# EAGLE design STM32F103C8T6 (EAGLE 9.6.2)
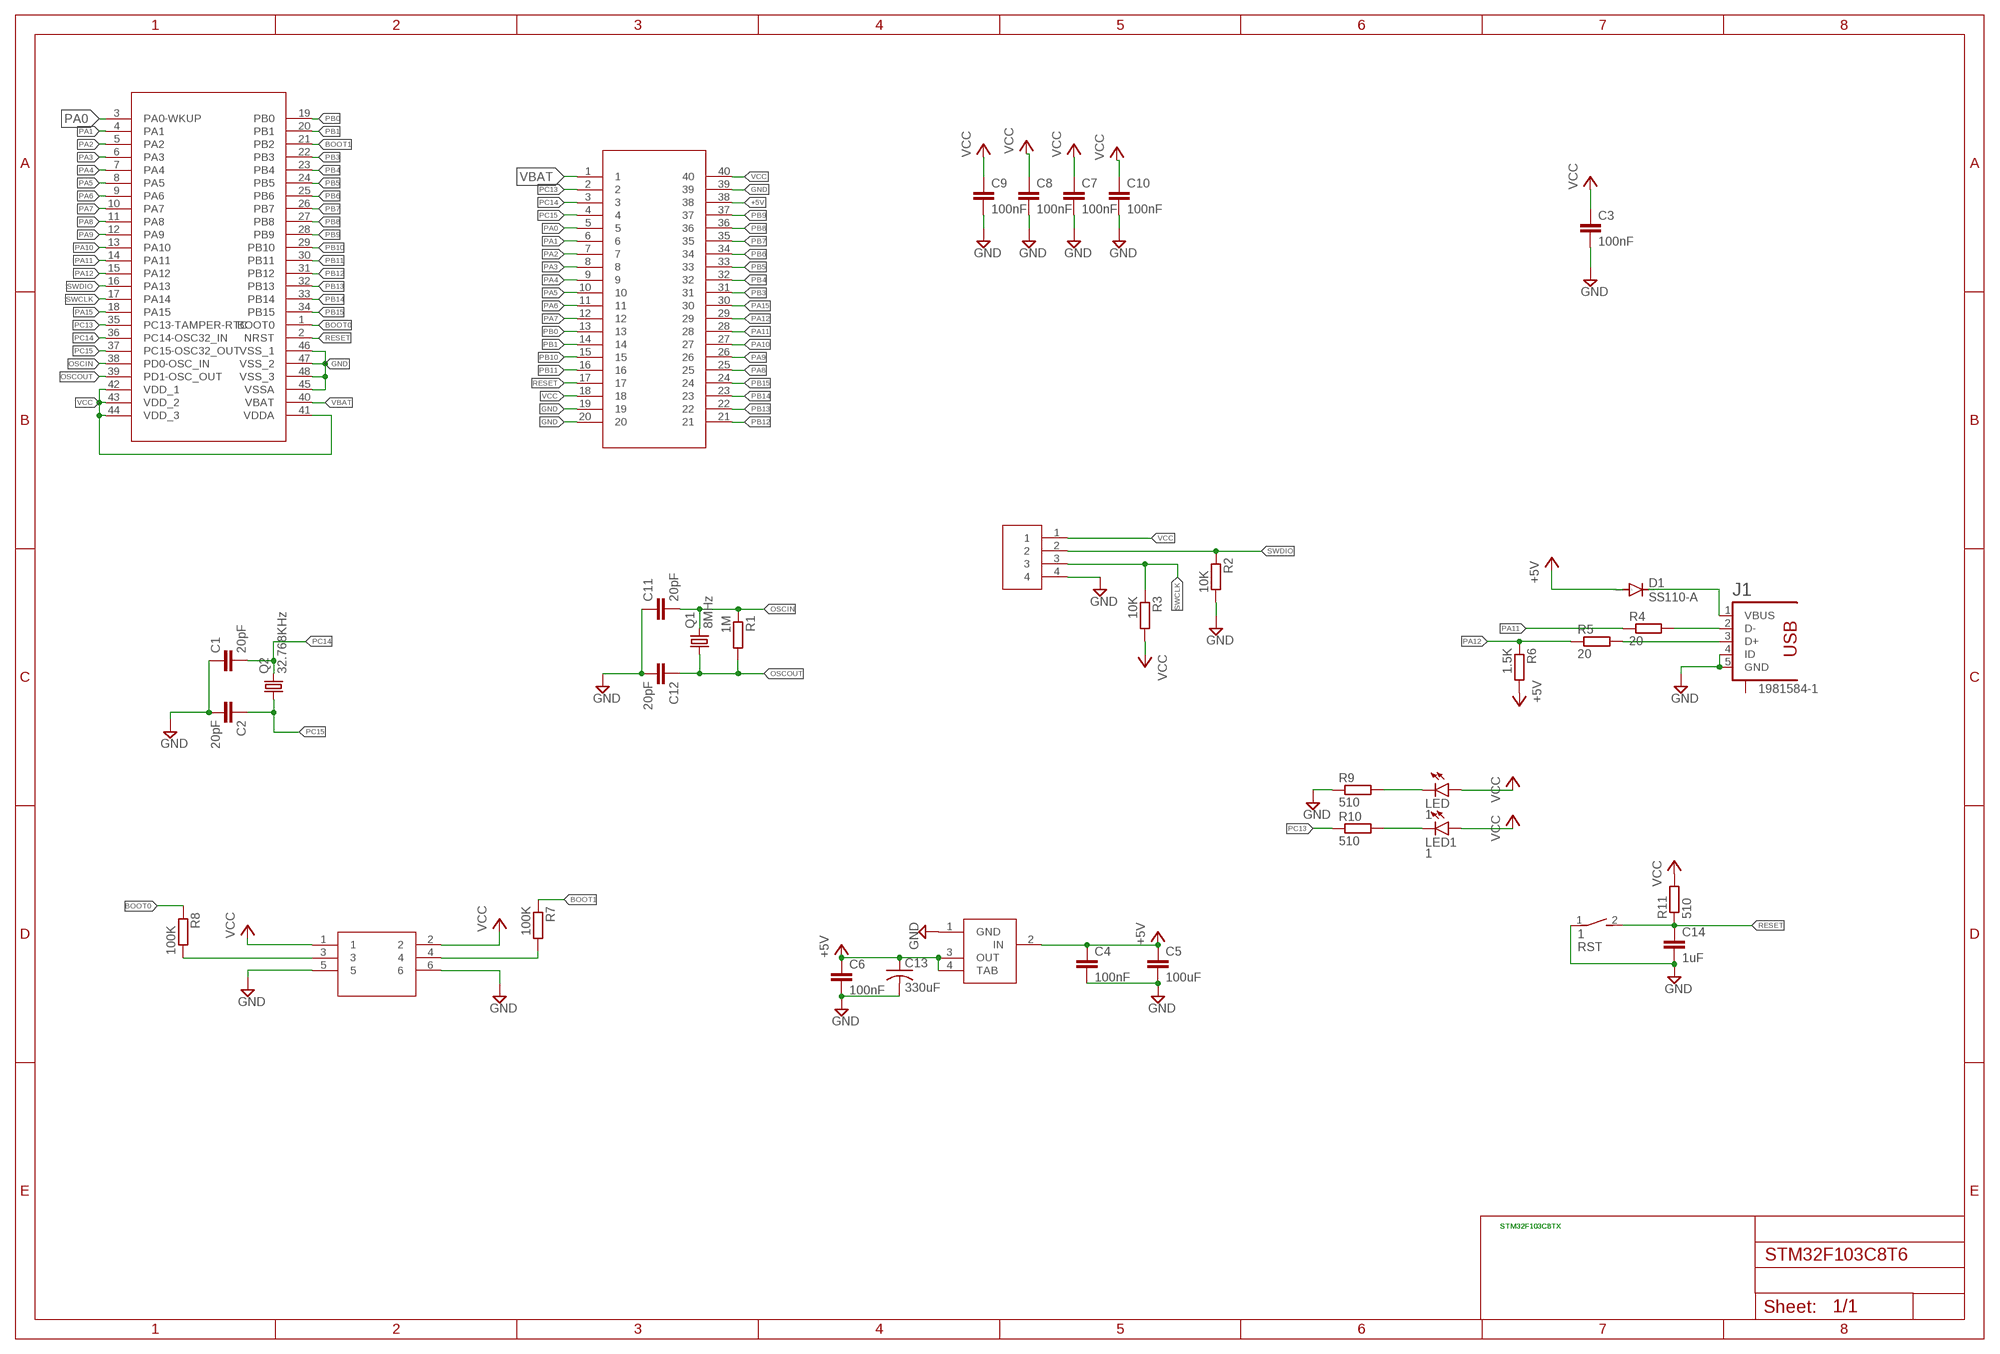
[diagram p0: schematic, sheet 1]

## Parts
1  RST  DS01E  [DS-01]
C1  20pF  C-EU025-024X044  [C025-024X044]
C2  20pF  C-EU025-024X044  [C025-024X044]
C3  100nF  C-EU025-024X044  [C025-024X044]
C4  100nF  C-EU025-024X044  [C025-024X044]
C5  100uF  C-EU025-024X044  [C025-024X044]
C6  100nF  C-EU025-024X044  [C025-024X044]
C7  100nF  C-EU025-024X044  [C025-024X044]
C8  100nF  C-EU025-024X044  [C025-024X044]
C9  100nF  C-EU025-024X044  [C025-024X044]
C10  100nF  C-EU025-024X044  [C025-024X044]
C11  20pF  C-EU025-024X044  [C025-024X044]
C12  20pF  C-EU025-024X044  [C025-024X044]
C13  330uF  C-US050-024X044  [C050-024X044]
C14  1uF  C-EU025-024X044  [C025-024X044]
D1  SS110-A  DIODE-D-2.5  [D-2.5]
J1  1981584-1  [1981584-1]
LED  1  LED3MM  [LED3MM]
LED1  1  LED3MM  [LED3MM]
Q1  8MHz  CRYSTALSM49  [SM49]
Q2  32.768KHz  CRYSTALSM49  [SM49]
R1  1M  R-EU_0204/2V  [0204V]
R2  10K  R-EU_0204/2V  [0204V]
R3  10K  R-EU_0204/2V  [0204V]
R4  20  R-EU_0204/2V  [0204V]
R5  20  R-EU_0204/2V  [0204V]
R6  1.5K  R-EU_0204/2V  [0204V]
R7  100K  R-EU_0204/2V  [0204V]
R8  100K  R-EU_0204/2V  [0204V]
R9  510  R-EU_0204/2V  [0204V]
R10  510  R-EU_0204/2V  [0204V]
R11  510  R-EU_0204/2V  [0204V]
U$1  STM32F103C8T6  [QFP50P1290X1290X120-48N]
U$2  GPINS  [HDRV40W64P254_20X2_1016X508X838B]
U$4  PLATE  [HDRV4W64P254_1X4_1016X508X838B]
U$5  IC  [DIP762W53P254L500H508Q6B]
U$6  SOT223  [SOT230P700X180-4N]

## Nets
+5V: D1.A LED1.A LED.A R6.2 R11.2 U$2.38 ; supply symbol labelled VCC
BOOT0: R8.1 U$1.1(BOOT0)
BOOT1: R7.1 U$1.21(PB2)
GND: 1.1 C1.1 C2.2 C3.2 C4.2 C5.2 C6.2 C7.2 C8.2 C9.2 C10.2 C11.1 C12.2 C13.2 C14.2 J1.4(ID) J1.5(GND) R2.2 R9.1 U$1.45(VSSA) U$1.46(VSS_1) U$1.47(VSS_2) U$1.48(VSS_3) U$2.19 U$2.20 U$2.39 U$4.4 U$5.5 U$5.6 U$6.1(GND)
N$1: D1.C J1.1(VBUS)
N$2: R8.2 U$5.3
N$3: J1.2(D-) R4.2
N$4: R7.2 U$5.4
N$5: J1.3(D+) R5.2
N$8: LED.K(C) R9.2
N$9: LED1.K(C) R10.2
OSCIN: C11.2 Q1.2 R1.1 U$1.38(PD0-OSC_IN)
OSCOUT: C12.1 Q1.1 R1.2 U$1.39(PD1-OSC_OUT)
PA0: U$1.3(PA0-WKUP) U$2.5
PA1: U$1.4(PA1) U$2.6
PA2: U$1.5(PA2) U$2.7
PA3: U$1.6(PA3) U$2.8
PA4: U$1.7(PA4) U$2.9
PA5: U$1.8(PA5) U$2.10
PA6: U$1.9(PA6) U$2.11
PA7: U$1.10(PA7) U$2.12
PA8: U$1.11(PA8) U$2.25
PA9: U$1.12(PA9) U$2.26
PA10: U$1.13(PA10) U$2.27
PA11: R4.1 U$1.14(PA11) U$2.28
PA12: R5.1 R6.1 U$1.15(PA12) U$2.29
PA15: U$1.18(PA15) U$2.30
PB0: U$1.19(PB0) U$2.13
PB1: U$1.20(PB1) U$2.14
PB3: U$1.22(PB3) U$2.31
PB4: U$1.23(PB4) U$2.32
PB5: U$1.24(PB5) U$2.33
PB6: U$1.25(PB6) U$2.34
PB7: U$1.26(PB7) U$2.35
PB8: U$1.27(PB8) U$2.36
PB9: U$1.28(PB9) U$2.37
PB10: U$1.29(PB10) U$2.15
PB11: U$1.30(PB11) U$2.16
PB12: U$1.31(PB12) U$2.21
PB13: U$1.32(PB13) U$2.22
PB14: U$1.33(PB14) U$2.23
PB15: U$1.34(PB15) U$2.24
PC13: R10.1 U$1.35(PC13-TAMPER-RTC) U$2.2
PC14: C1.2 Q2.2 U$1.36(PC14-OSC32_IN) U$2.3
PC15: C2.1 Q2.1 U$1.37(PC15-OSC32_OUT) U$2.4
RESET: 1.2 C14.1 R11.1 U$1.2(NRST) U$2.17
SWCLK: R3.1 U$1.17(PA14) U$4.3
SWDIO: R2.1 U$1.16(PA13) U$4.2
VBAT: U$1.40(VBAT) U$2.1
VCC: C3.1 C4.1 C5.1 C6.1 C7.1 C8.1 C9.1 C10.1 C13.1 R3.2 U$1.41(VDDA) U$1.42(VDD_1) U$1.43(VDD_2) U$1.44(VDD_3) U$2.18 U$2.40 U$4.1 U$5.1 U$5.2 U$6.2(IN) U$6.3(OUT) U$6.4(TAB) ; supply symbol labelled +5V
Unconnected: J1.S1

## Notes on the sheet
- STM32F103C8TX | STM32F103C8TX

## Library data of the parts
1 = switch-dil:DS01E: DIL/CODE SWITCH; OC_FARNELL: unknown; OC_NEWARK: unknown
C1-C12 C14 = rcl:C-EU: CAPACITOR, European symbol; SPICEPREFIX: C
C13 = rcl:C-US: CAPACITOR, American symbol; SPICEPREFIX: C
D1 = diode:DIODE-: DIODE
J1 = audio amplifier example:1981584-1: Receptacle, micro-USB, type A/B Tyco Electronics
LED LED1 = led:LED: LED OSRAM: - CHIPLED LG R971, LG N971, LY N971, LG Q971, LY Q971, LO R971, LY R971 LH N974, LH R974 LS Q976, LO Q976, LY Q976 LO Q996 - Hyper CHIPLED LW Q18S LB Q993, LB Q99A, LB R99A - SideLED LS A670, LO A670, LY A670, LG A670, LP A670 LB A673, LV A673, LT A673, LW A673 LH A674 LY A675 LS A676, LA A676, LO A676, LY A676, LW A676 LS A679, LY A679, LG A679 - Hyper Micro SIDELED® LS Y876, LA Y876, LO Y876, LY Y876 LT Y87S - SmartLED LW L88C, LW L88S LB L89C, LB L89S, LG L890 LS L89K, LO L89K, LY L89K LS L896, LA L896, LO L896, LY L896 - TOPLED LS T670, LO T670, LY T670, LG T670, LP T670 LSG T670, LSP T670, LSY T670, LOP T670, LYG T670 LG T671, LOG T671, LSG T671 LB T673, LV T673, LT T673, LW T673 LH T674 LS T676, LA T676, LO T676, LY T676, LB T676, LH T676, LSB T676, LW T676 LB T67C, LV T67C, LT T67C, LS T67K, LO T67K, LY T67K, LW E67C LS E67B, LA E67B, LO E67B, LY E67B, LB E67C, LV E67C, LT E67C LW T67C LS T679, LY T679, LG T679 LS T770, LO T770, LY T770, LG T770, LP T770 LB T773, LV T773, LT T773, LW T773 LH T774 LS E675, LA E675, LY E675, LS T675 LS T776, LA T776, LO T776, LY T776, LB T776 LHGB T686 LT T68C, LB T68C - Hyper Mini TOPLED® LB M676 - Mini TOPLED Santana® LG M470 LS M47K, LO M47K, LY M47K Source: http://www.osram.convergy.de LUXEON: - LUMILED® LXK2-PW12-R00, LXK2-PW12-S00, LXK2-PW14-U00, LXK2-PW14-V00 LXK2-PM12-R00, LXK2-PM12-S00, LXK2-PM14-U00 LXK2-PE12-Q00, LXK2-PE12-R00, LXK2-PE12-S00, LXK2-PE14-T00, LXK2-PE14-U00 LXK2-PB12-K00, LXK2-PB12-L00, LXK2-PB12-M00, LXK2-PB14-N00, LXK2-PB14-P00, LXK2-PB14-Q00 LXK2-PR12-L00, LXK2-PR12-M00, LXK2-PR14-Q00, LXK2-PR14-R00 LXK2-PD12-Q00, LXK2-PD12-R00, LXK2-PD12-S00 LXK2-PH12-R00, LXK2-PH12-S00 LXK2-PL12-P00, LXK2-PL12-Q00, LXK2-PL12-R00 Source: www.luxeon.com KINGBRIGHT: KA-3528ASYC Source: www.kingbright.com
Q1 Q2 = crystal:CRYSTAL: CRYSTAL; OC_FARNELL: unknown; OC_NEWARK: unknown
R1-R11 = rcl:R-EU_: RESISTOR, European symbol; SPICEPREFIX: R
U$1 = STM32F103C8T6:STM32F103C8T6
U$2 = PLATES:GPINS
U$4 = PLATE:PLATE
U$5 = BOX:IC
U$6 = SOT:SOT223

## Board
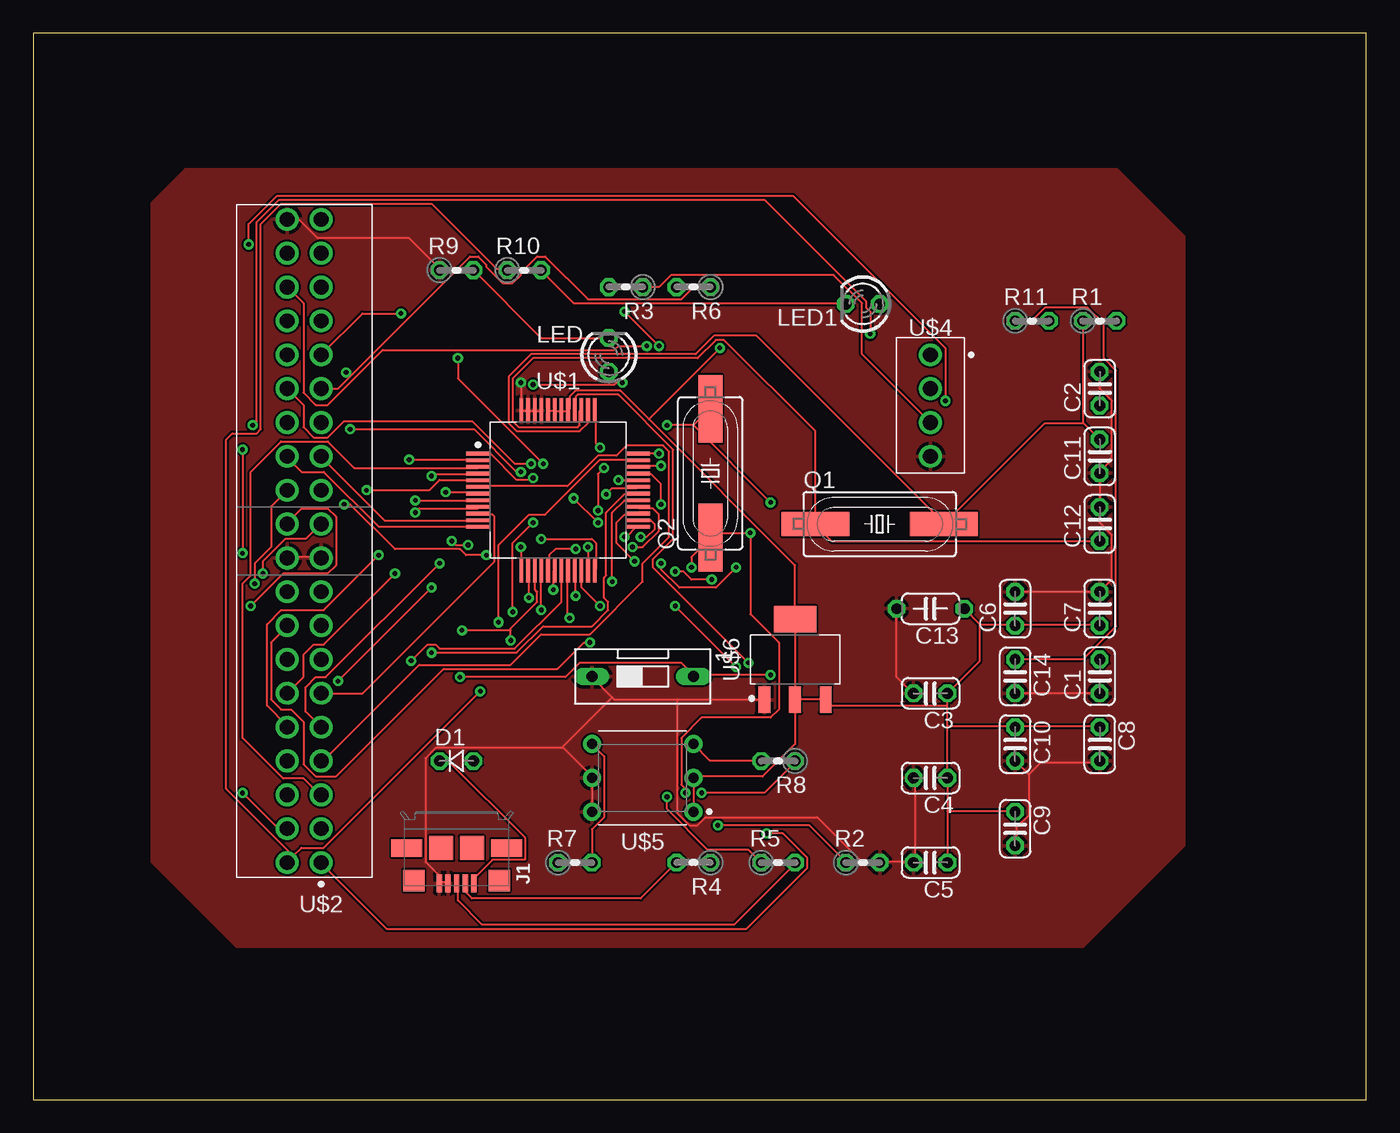
[diagram p1: board, top side]
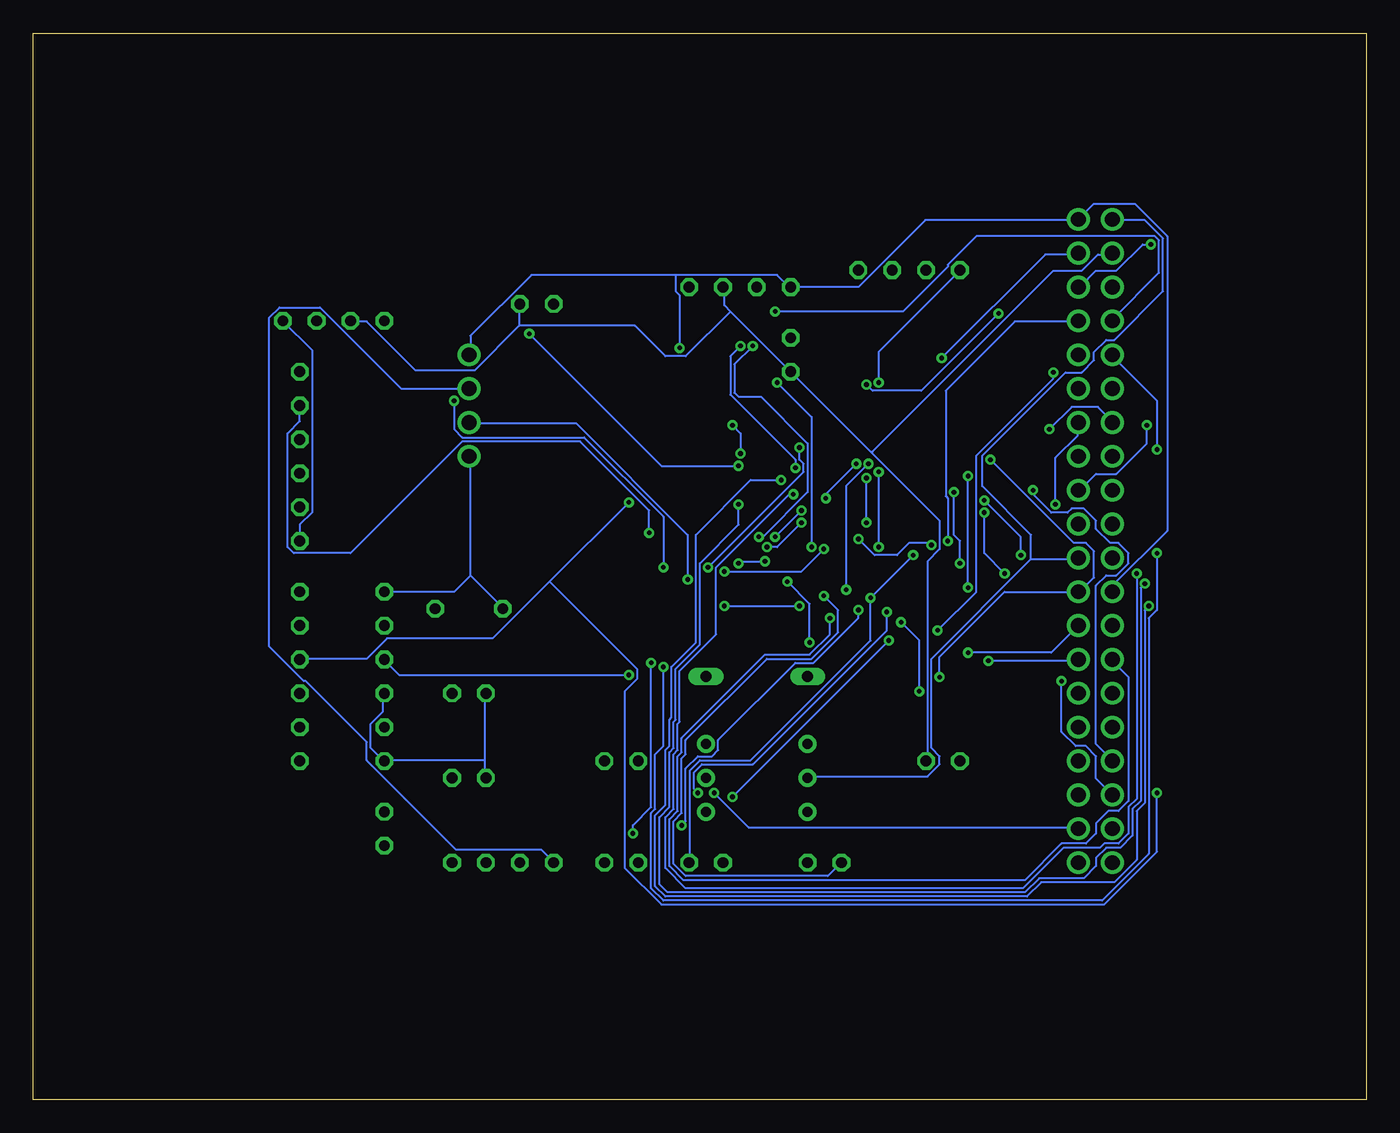
[diagram p2: board, bottom side, seen from below]

Size 100 x 80 mm. Coordinates in mm from the lower left corner, seen from the top.
Outline: 0,0 100,0 100,80 0,80 0,0
Copper layers (1*16): Top 0.035mm / dielectric 1.5mm / Bottom 0.035mm
Design rules "default": minimum track width 6mil, minimum drill 0.35mm, track to track 6mil, track to pad 6mil, pad to pad 6mil, via to via 6mil, smd to smd 6mil, copper to edge 40mil, drill to drill 6mil, minimum pad ring 10mil, minimum via ring 8mil, stop-mask expansion 4mil, vias tented up to drill 0mil, thermal gap 10mil

### Footprints (pad centres in the part's own frame; a part is rotated, then mirrored left to right if it is on the bottom)
DS-01 = drill 0.813 long: 1 0,-3.81; 2 0,3.81
C025-024X044 = drill 0.813 octagon: 1 -1.27,0; 2 1.27,0
C050-024X044 = drill 0.813 octagon: 1 -2.54,0; 2 2.54,0
D-2.5 = drill 0.813 octagon: A 1.27,0; C -1.27,0
1981584-1 = smd 0.4 x 1.35: 1 -1.3,4.1; 2 -0.65,4.1; 3 0,4.1; 4 0.65,4.1; 5 1.3,4.1 | smd 1.8 x 1.8: M1 -1.15,1.45; M2 1.15,1.45 | smd 2.3 x 1.3: S1 -3.75,1.45; S2 3.75,1.45 | smd 1.6 x 1.6: S3 -3.2,3.885; S4 3.2,3.885
LED3MM = drill 0.813 octagon: A -1.27,0; K 1.27,0
SM49 = smd 5.08 x 1.778: 1 -4.826,0; 2 4.826,0
0204V = drill 0.813 octagon: 1 -1.27,0; 2 1.27,0
QFP50P1290X1290X120-48N = smd 1.852 x 0.28: 1 -5.982,2.75; 2 -5.982,2.25; 3 -5.982,1.75; 4 -5.982,1.25; 5 -5.982,0.75; 6 -5.982,0.25; 7 -5.982,-0.25; 8 -5.982,-0.75; 9 -5.982,-1.25; 10 -5.982,-1.75; 11 -5.982,-2.25; 12 -5.982,-2.75; 25 5.982,-2.75; 26 5.982,-2.25; 27 5.982,-1.75; 28 5.982,-1.25; 29 5.982,-0.75; 30 5.982,-0.25; 31 5.982,0.25; 32 5.982,0.75; 33 5.982,1.25; 34 5.982,1.75; 35 5.982,2.25; 36 5.982,2.75 | smd 0.28 x 1.852: 13 -2.75,-5.982; 14 -2.25,-5.982; 15 -1.75,-5.982; 16 -1.25,-5.982; 17 -0.75,-5.982; 18 -0.25,-5.982; 19 0.25,-5.982; 20 0.75,-5.982; 21 1.25,-5.982; 22 1.75,-5.982; 23 2.25,-5.982; 24 2.75,-5.982; 37 2.75,5.982; 38 2.25,5.982; 39 1.75,5.982; 40 1.25,5.982; 41 0.75,5.982; 42 0.25,5.982; 43 -0.25,5.982; 44 -0.75,5.982; 45 -1.25,5.982; 46 -1.75,5.982; 47 -2.25,5.982; 48 -2.75,5.982
HDRV40W64P254_20X2_1016X508X838B = drill 1.105 pad 1.705: 1 0,0; 2 2.54,0; 3 2.54,-2.54; 4 0,-2.54; 5 0,-5.08; 6 2.54,-5.08; 7 2.54,-7.62; 8 0,-7.62; 9 0,-10.16; 10 2.54,-10.16; 11 2.54,-12.7; 12 0,-12.7; 13 0,-15.24; 14 2.54,-15.24; 15 2.54,-17.78; 16 0,-17.78; 17 0,-20.32; 18 2.54,-20.32; 19 2.54,-22.86; 20 0,-22.86; 21 0,-25.4; 22 2.54,-25.4; 23 2.54,-27.94; 24 0,-27.94; 25 0,-30.48; 26 2.54,-30.48; 27 2.54,-33.02; 28 0,-33.02; 29 0,-35.56; 30 2.54,-35.56; 31 2.54,-38.1; 32 0,-38.1; 33 0,-40.64; 34 2.54,-40.64; 35 2.54,-43.18; 36 0,-43.18; 37 0,-45.72; 38 2.54,-45.72; 39 2.54,-48.26; 40 0,-48.26
HDRV4W64P254_1X4_1016X508X838B = drill 1.105 pad 1.705: 1 0,0; 2 2.54,0; 3 5.08,0; 4 7.62,0
DIP762W53P254L500H508Q6B = drill 0.743 pad 1.343: 1 -3.81,2.54; 2 -3.81,0; 3 -3.81,-2.54; 4 3.81,-2.54; 5 3.81,0; 6 3.81,2.54
SOT230P700X180-4N = smd 1.965 x 0.889: 1 -3.023,2.3; 2 -3.023,0; 3 -3.023,-2.3 | smd 1.965 x 3.189: 4 3.023,0

### Placement (x,y rotation side)
1  45.72,31.75 270 top
C1  80.01,31.75 90 top
C2  80.01,53.34 90 top
C3  67.31,30.48 180 top
C4  67.31,24.13 180 top
C5  67.31,17.78 180 top
C6  73.66,36.83 90 top
C7  80.01,36.83 90 top
C8  80.01,26.67 270 top
C9  73.66,20.32 270 top
C10  73.66,26.67 270 top
C11  80.01,48.26 90 top
C12  80.01,43.18 90 top
C13  67.31,36.83 180 top
C14  73.66,31.75 270 top
D1  31.75,25.4 0 top
J1  31.75,20.32 180 top
LED  43.18,55.88 90 top
LED1  62.23,59.69 180 top
Q1  63.5,43.18 0 top
Q2  50.8,46.99 90 top
R1  80.01,58.42 0 top
R2  62.23,17.78 0 top
R3  44.45,60.96 180 top
R4  49.53,17.78 180 top
R5  55.88,17.78 0 top
R6  49.53,60.96 180 top
R7  40.64,17.78 0 top
R8  55.88,25.4 180 top
R9  31.75,62.23 0 top
R10  36.83,62.23 0 top
R11  74.93,58.42 0 top
U$1  39.37,45.72 0 top
U$2  21.59,17.78 180 top
U$4  67.31,55.88 270 top
U$5  45.72,24.13 180 top
U$6  57.15,33.02 90 top

### Tracks (layer width: path | path; a pad name or v marks a point on that pad's centre or on a via)
+5V
  Bottom 0.152: 63.55,58.06 66.9,54.71 71.32,54.71 74.98,58.37 76.2,58.37 R11.2 | 63.55,58.06 63.55,59.59 LED1.A | 37.19,48.62 LED.A 47.7,59.13 | 37.19,48.62 32,43.43 32,41.3 32.92,40.39 32.92,25.45 D1.A | 47.7,59.13 48.16,59.59 48.16,60.96 R6.2 | 37.19,48.62 37.03,48.62 23.47,62.18 21.34,62.18 20.12,63.4 19.05,63.4 U$2.38 | 63.55,58.06 54.86,58.06 52.58,55.78 51.05,55.78 47.7,59.13
BOOT0  (via drill 0.35)
  Top 0.152: v37.49,46.63 37.34,46.48 36.27,46.48 34.29,48.46 33.53,48.46 U$1.1 | v37.49,43.28 35.97,41.76 v35.97,36.58 | v50.14,23.01 54.86,23.01 57.15,25.3 R8.1
  Bottom 0.152: v37.49,43.28 v37.49,46.63 | v35.97,36.58 35.97,35.2 46.02,25.15 49.84,25.15 50.44,24.54 50.44,23.32 v50.14,23.01
BOOT1  (via drill 0.35)
  Top 0.152: v40.69,37.8 40.69,39.62 U$1.21
  Bottom 0.152: v40.69,37.8 39.62,36.73 39.62,35.05 41.6,33.07 44.96,33.07 51.05,26.98 51.05,25.91 51.36,25.6 51.36,21.49 51.97,20.88 51.97,17.68 51.05,16.76 40.39,16.76 R7.1
GND  (via drill 0.35)
  Top 0.152: C1.1 C14.2 | 74.68,24.38 74.68,21.34 73.76,20.42 73.76,19.05 C9.2 | C10.2 74.68,24.38 | 74.68,24.38 75.59,25.3 80.01,25.3 C8.2 | C2.2 80.01,53.34 80.92,52.43 80.92,48.01 80.01,47.09 C11.1 C12.2 80.01,43.28 80.92,42.37 80.92,39.01 C7.2 C6.2 | C13.2 64.77,31.7 65.99,30.48 C3.2 | C4.2 66.14,24.08 66.14,17.83 C5.2 65.99,17.83 63.55,17.83 R2.2 63.4,17.83 62.18,17.83 58.83,21.18 50.44,21.18 49.84,20.57 49.23,20.57 48.31,21.49 48.31,30.02 | U$1.45 38.1,51.66 37.64,51.66 U$1.46 37.49,51.66 37.19,51.66 U$1.47 37.03,51.66 36.73,51.66 U$1.48 36.58,51.82 v36.58,53.8 | U$2.39 19.05,65.99 19.96,65.99 21.34,64.62 28.19,64.62 30.48,62.33 R9.1 | 48.31,30.02 43.59,30.02 43.43,30.18 | 48.31,30.02 54.71,30.02 U$6.1 | 43.43,30.18 41.91,31.7 1.1 | U$2.19 19.05,40.69 21.49,40.69 U$2.20 | J1.4 31.09,16.31 30.48,16.31 J1.5 30.33,16.31 30.33,16.92 29.41,17.83 29.41,25.6 30.18,26.36 39.62,26.36 | 39.62,26.36 39.78,26.36 41.91,24.23 U$5.5 U$5.6 | 39.62,26.36 43.43,30.18
  Bottom 0.152: C14.2 73.76,30.48 73.76,29.11 74.68,28.19 74.68,26.36 73.76,25.45 C10.2 73.61,25.45 66.14,25.45 | 66.14,25.45 66.14,30.48 C3.2 | 66.14,25.45 66.14,24.23 C4.2 | 67.21,39.32 67.21,48.16 U$4.4 | 67.21,39.32 64.77,36.88 C13.2 | C6.2 68.43,38.1 67.21,39.32 | v36.58,53.8 36.58,56.08 30.48,62.18 R9.1 | 25.15,40.54 21.64,40.54 U$2.20 | 25.15,40.54 32.61,33.07 32.61,26.36 32,25.76 32,25.15 32.92,24.23 41.91,24.23 U$5.5 | 25.15,40.54 25.15,42.37 28.8,46.02 28.8,48.31 22.55,54.56 21.34,54.56 20.42,55.47 20.42,56.08 19.51,57 18.9,57 15.24,60.66 15.24,64.62 16.61,65.99 19.05,65.99 U$2.39
  pour Top: 11.43,69.85 81.28,69.85 86.36,64.77 86.36,19.05 78.74,11.43 15.24,11.43 8.89,17.78 8.89,67.31
N$1
  Top 0.152: J1.1 33.07,16.31 33.07,16.61 34.44,17.98 36.88,17.98 36.88,19.66 31.24,25.3 30.48,25.3 D1.C
N$2
  Top 0.152: U$5.3 50.75,25.45 54.56,25.45 R8.2
N$3
  Top 0.152: R4.2 45.57,15.09 32.92,15.09 32.46,15.54 32.46,16.15 J1.2
N$4
  Top 0.152: R7.2 41.91,20.27 42.82,21.18 42.82,25.76 U$5.4
N$5
  Top 0.152: J1.3 31.85,16.15 31.85,14.94 33.68,13.11 52.58,13.11 57.15,17.68 R5.2
N$8
  Top 0.152: LED.K 38.1,57.15 R9.2
N$9
  Top 0.152: LED1.K 60.96,59.74 40.54,59.74 38.1,62.18 R10.2
OSCIN
  Top 0.152: 78.79,50.75 78.79,58.37 R1.1 | C11.2 78.79,50.75 | U$1.38 41.6,51.66 41.6,50.75 41,50.14 36.27,50.14 35.66,50.75 35.66,54.25 37.34,55.93 49.68,55.93 51.05,57.3 54.25,57.3 68.28,43.28 Q1.2 75.89,50.75 78.79,50.75
OSCOUT
  Top 0.152: U$1.39 41,51.66 41,50.6 40.84,50.44 36.42,50.44 35.97,50.9 35.97,54.1 37.49,55.63 49.84,55.63 51.21,57 51.82,57 58.67,50.14 Q1.1 58.67,43.13 59.89,41.91 C12.1
  Bottom 0.152: C12.1 80.01,43.13 79.1,44.04 79.1,56.24 R1.2
PA0
  Top 0.152: U$1.3 33.38,47.4 24.08,47.4 22.1,49.38 18.59,49.38 16.31,47.09 16.31,39.32 15.7,38.71 15.7,27.13 18.75,24.08 20.27,24.08 21.49,22.86 U$2.5
PA1  (via drill 0.35)
  Top 0.152: v29.87,46.79 30.02,46.94 33.38,46.94 U$1.4 | v22.86,31.39 v29.87,38.41
  Bottom 0.152: v29.87,38.41 v29.87,46.79 | v22.86,31.39 22.86,27.58 21.79,26.52 21.03,26.52 20.27,25.76 20.27,24.08 U$2.6
PA2  (via drill 0.35)
  Top 0.152: v24.99,45.72 29.72,45.72 30.48,46.48 33.38,46.48 U$1.5
  Bottom 0.152: v24.99,45.72 24.99,45.41 23.62,44.04 22.4,44.04 22.1,44.35 21.18,44.35 20.27,43.43 20.27,42.82 19.2,41.76 18.59,41.76 17.83,41 17.83,40.23 18.75,39.32 19.51,39.32 20.27,38.56 20.27,26.67 19.05,25.45 U$2.7
PA3
  Top 0.152: U$1.6 33.53,46.02 40.08,46.02 42.37,48.31 43.74,48.31 44.5,49.07 47.24,49.07 47.7,48.62 47.7,42.22 45.72,40.23 45.72,38.86 41.76,34.9 38.1,34.9 35.81,32.61 28.96,32.61 21.64,25.3 U$2.8
PA4  (via drill 0.35)
  Top 0.152: v30.94,45.57 33.38,45.57 U$1.7 | v30.48,40.23 21.95,31.7 21.18,31.7 20.42,30.94 20.42,29.11 U$2.9
  Bottom 0.152: v30.94,45.57 30.94,42.37 30.48,41.91 v30.48,40.23
PA5  (via drill 0.35)
  Top 0.152: v28.65,44.96 33.38,44.96 U$1.8 | v25.91,40.84 21.79,36.73 18.59,36.73 17.53,35.66 17.53,29.57 19.05,28.04 U$2.10
  Bottom 0.152: v28.65,44.96 25.91,42.22 v25.91,40.84
PA6  (via drill 0.35)
  Top 0.152: v28.65,44.04 28.96,44.35 33.38,44.35 U$1.9 | v27.13,39.47 21.79,34.14 21.03,34.14 20.27,33.38 20.27,31.7 U$2.11
  Bottom 0.152: v28.65,44.04 28.65,41 v27.13,39.47
PA7
  Top 0.152: U$2.12 24.69,30.48 34.59,40.39 34.59,43.74 34.44,43.89 33.53,43.89 U$1.10
PA8
  Top 0.152: U$1.11 33.38,43.43 26.36,43.43 21.64,48.16 U$2.25
PA9
  Top 0.152: U$1.12 33.38,42.98 25.91,42.98 21.79,47.09 20.12,47.09 19.05,48.16 U$2.26
PA10  (via drill 0.35)
  Top 0.152: v36.58,41.45 36.58,39.78 U$1.13 | v36.58,47.09 36.27,47.09 33.07,50.29 v23.77,50.29
  Bottom 0.152: v36.58,47.09 v36.58,41.45 | v23.77,50.29 22.1,51.97 20.12,51.97 19.05,50.9 U$2.27
PA11  (via drill 0.35)
  Top 0.152: v37.19,37.64 37.19,39.62 U$1.14 | v23.32,44.65 23.77,44.65 27.13,41.3 32,41.3 32.46,40.84 v33.98,40.84
  Bottom 0.152: R4.1 50.75,17.83 50.75,24.69 49.99,25.45 46.18,25.45 37.19,34.44 v37.19,37.64 v33.98,40.84 | v23.32,44.65 23.32,48.16 21.64,49.84 21.64,50.75 U$2.28
PA12  (via drill 0.35)
  Top 0.152: R6.1 49.53,60.96 48.62,60.05 41.6,60.05 38.41,63.25 37.8,63.25 36.58,62.03 36.58,61.87 35.97,61.27 35.2,61.27 33.98,62.48 33.98,62.64 33.38,63.25 32.77,63.25 23.77,54.25 | 23.77,54.25 22.86,53.34 U$2.29 | v35.81,34.44 35.81,35.2 | 35.81,35.2 35.81,35.36 37.8,37.34 37.8,38.1 37.64,38.25 37.64,39.62 U$1.15 | v47.55,22.71 47.55,21.79 50.6,18.75 53.65,18.75 R5.1 | v23.47,54.56 23.77,54.25 | 35.81,35.2 v32.16,35.2
  Bottom 0.152: v47.55,22.71 v35.81,34.44 | v23.47,54.56 23.47,54.1 29.26,48.31 29.26,38.1 v32.16,35.2
PA15  (via drill 0.35)
  Top 0.152: v39.01,38.25 39.01,39.62 U$1.18 | v37.34,47.7 36.12,47.7 32.92,50.9 23.32,50.9 22.1,49.68 21.03,49.68 20.27,50.44 20.27,52.12 U$2.30
  Bottom 0.152: v39.01,38.25 39.01,46.02 v37.34,47.7
PB0  (via drill 0.35)
  Top 0.152: v28.35,32.92 29.57,34.14 30.18,34.14 30.48,33.83 36.12,33.83 39.62,37.34 39.62,39.62 U$1.19
  Bottom 0.152: v28.35,32.92 21.64,32.92 U$2.13
PB1  (via drill 0.35)
  Top 0.152: v40.23,36.12 40.08,36.27 40.08,39.62 U$1.20
  Bottom 0.152: v40.23,36.12 40.23,34.9 41.76,33.38 45.11,33.38 51.36,27.13 51.36,26.06 51.66,25.76 51.66,21.64 52.27,21.03 52.27,17.53 51.21,16.46 25.6,16.46 22.86,19.2 21.03,19.2 20.27,19.96 20.27,20.73 19.36,21.64 18.59,21.64 17.83,22.4 17.83,31.7 19.05,32.92 U$2.14
PB3  (via drill 0.35)
  Top 0.152: v42.52,37.03 41.15,38.41 41.15,39.62 U$1.22 | v52.73,32.46 v48.16,37.03 | v15.7,48.77 v15.7,41
  Bottom 0.152: v48.16,37.03 v42.52,37.03 | v52.73,32.46 52.73,26.52 53.34,25.91 53.34,21.79 53.65,21.49 53.65,15.85 52.73,14.94 19.81,14.94 16.31,18.44 16.31,36.12 15.7,36.73 v15.7,41 | v15.7,48.77 15.7,52.43 19.05,55.78 U$2.31
PB4  (via drill 0.35)
  Top 0.152: v41.6,41.45 41.6,39.78 U$1.23 | v44.2,53.8 43.74,53.8 43.59,53.65 v37.49,53.65 | v27.58,58.98 24.69,58.98 U$2.32
  Bottom 0.152: v41.6,41.45 41.6,51.21 v44.2,53.8 | v37.49,53.65 37.03,53.19 33.38,53.19 v27.58,58.98
PB5  (via drill 0.35)
  Top 0.152: v38.1,42.06 41.91,42.06 42.22,41.76 42.22,39.78 U$1.24 | v32.61,41.6 31.7,41.6 v31.39,41.91
  Bottom 0.152: v38.1,42.06 36.88,40.84 35.2,40.84 34.29,41.76 32.77,41.76 v32.61,41.6 | v31.39,41.91 31.39,45.11 31.55,45.26 31.55,53.19 26.36,58.37 21.64,58.37 U$2.33
PB6  (via drill 0.35)
  Top 0.152: v44.35,42.22 44.5,42.22 45.26,42.98 U$1.25 | v42.37,44.2 42.37,46.94 v42.82,47.4 | v44.35,59.13 v46.94,56.54
  Bottom 0.152: v42.37,44.2 v44.35,42.22 | v42.82,47.4 42.82,48.01 47.7,52.88 47.7,55.78 v46.94,56.54 | v44.35,59.13 34.75,59.13 31.39,62.48 31.39,62.64 29.26,64.77 15.85,64.77 15.54,64.47 15.54,62.03 19.05,58.52 U$2.34
PB7  (via drill 0.35)
  Top 0.152: v45.57,42.22 46.02,42.22 46.63,42.82 46.63,43.13 46.33,43.43 45.41,43.43 U$1.26 | v46.02,56.54 43.89,56.54 43.59,56.24 26.21,56.24 22.1,52.12 21.18,52.12 20.27,53.03 20.27,59.74 U$2.35
  Bottom 0.152: v45.57,42.22 45.26,42.22 41.91,45.57 41.91,49.23 45.41,52.73 47.09,52.73 47.4,53.03 47.4,55.17 v46.02,56.54
PB8  (via drill 0.35)
  Top 0.152: v45.11,40.39 43.74,41.76 43.74,43.28 44.35,43.89 45.26,43.89 U$1.27 | v47.09,40.23 47.09,39.78 48.46,38.41 51.21,38.41 v52.73,39.93 | v68.43,52.43 68.43,56.39 57,67.82 18.29,67.82 16.15,65.68 v16.15,64.16
  Bottom 0.152: v45.11,40.39 46.94,40.39 v47.09,40.23 | v52.73,39.93 52.73,43.74 58.67,49.68 67.82,49.68 68.43,50.29 v68.43,52.43 | v16.15,64.16 16.76,64.16 18.75,62.18 20.27,62.18 21.49,60.96 U$2.36
PB9  (via drill 0.35)
  Top 0.152: v44.96,41.45 45.72,41.45 46.94,42.67 46.94,43.89 46.48,44.35 45.41,44.35 U$1.28 | v40.54,45.11 v42.37,43.28 | v38.25,47.7 31.85,54.1 v31.85,55.63
  Bottom 0.152: v44.96,41.45 44.2,41.45 v42.37,43.28 | v40.54,45.11 40.54,45.41 v38.25,47.7 | v31.85,55.63 24.08,63.4 21.64,63.4 U$2.37
PB10  (via drill 0.35)
  Top 0.152: v43.43,38.86 43.43,44.04 44.35,44.96 45.26,44.96 U$1.29 | v41.76,34.29 41.3,34.29 39.32,32.31 30.79,32.31 22.71,24.23 21.18,24.23 20.27,25.15 20.27,28.35 19.36,29.26 18.59,29.26 17.83,30.02 17.83,34.29 19.05,35.51 U$2.15
  Bottom 0.152: v43.43,38.86 41.76,37.19 v41.76,34.29
PB11  (via drill 0.35)
  Top 0.152: v29.87,33.53 36.27,33.53 38.25,35.51 41.91,35.51 43.13,36.73 43.13,37.34 42.82,37.64 42.82,39.17 42.98,39.32 42.98,44.04 44.35,45.41 45.26,45.41 U$1.30
  Bottom 0.152: v29.87,33.53 23.62,33.53 U$2.16
PB12  (via drill 0.35)
  Top 0.152: v42.98,45.41 43.43,45.87 45.26,45.87 U$1.31 | v17.22,39.47 17.22,40.39 18.9,42.06 20.42,42.06 21.49,43.13 U$2.21
  Bottom 0.152: v42.98,45.41 43.28,45.41 48.77,39.93 48.77,34.9 51.51,32.16 51.51,28.35 51.66,28.19 51.66,26.21 51.97,25.91 51.97,21.79 52.58,21.18 52.58,17.37 51.05,15.85 25.76,15.85 22.71,18.9 19.96,18.9 19.66,19.2 18.59,19.2 17.83,19.96 17.83,21.95 17.22,22.55 v17.22,39.47
PB13  (via drill 0.35)
  Top 0.152: v43.89,46.48 45.26,46.48 U$1.32 | v16.31,37.03 18.75,39.47 22.1,39.47 22.71,40.08 22.71,43.74 22.1,44.35 20.12,44.35 19.05,43.28 U$2.22
  Bottom 0.152: v43.89,46.48 46.18,46.48 50.29,42.37 50.29,34.29 52.12,32.46 52.12,28.65 52.27,28.5 52.27,26.52 52.58,26.21 52.58,22.1 53.34,21.34 53.34,16 52.58,15.24 25.45,15.24 24.38,16.31 18.9,16.31 17.22,17.98 17.22,21.64 16.61,22.25 16.61,36.73 v16.31,37.03
PB14  (via drill 0.35)
  Top 0.152: v47.09,44.65 47.09,46.18 46.33,46.94 45.41,46.94 U$1.33 | v16.61,38.71 16.61,40.23 17.83,41.45 17.83,44.5 U$2.23
  Bottom 0.152: v47.09,44.65 47.09,43.13 49.99,40.23 49.99,34.14 51.82,32.31 51.82,28.5 51.97,28.35 51.97,26.36 52.27,26.06 52.27,21.95 53.03,21.18 53.03,16.15 52.43,15.54 25.6,15.54 24.54,16.61 21.18,16.61 20.27,17.53 20.27,18.14 19.51,18.9 18.44,18.9 17.53,19.81 17.53,21.79 16.92,22.4 16.92,38.41 v16.61,38.71
PB15  (via drill 0.35)
  Top 0.152: v47.09,47.55 45.41,47.55 U$1.34 | v62.79,57.45 62.79,59.13 62.48,59.44 62.48,59.89 54.86,67.51 18.44,67.51 16.76,65.84 16.76,50.9 v16.46,50.6
  Bottom 0.152: v47.09,47.55 52.88,47.55 v62.79,57.45 | v16.46,50.6 16.46,49.23 18.75,46.94 20.27,46.94 21.49,45.72 U$2.24
PC13  (via drill 0.35)
  Top 0.152: v34.9,35.81 34.9,41.6 37.19,43.89 38.41,43.89 42.52,48.01 45.26,48.01 U$1.35 | v33.53,30.63 21.79,18.9 20.12,18.9 19.51,18.29 | 19.51,18.29 19.05,17.83 U$2.2 19.51,18.29 | 19.51,18.29 14.48,23.32 14.48,49.53 14.94,49.99 16.76,49.99 17.07,50.29 17.07,65.68 18.59,67.21 29.87,67.21 34.75,62.33 35.51,62.33 R10.1
  Bottom 0.152: v34.9,35.81 33.53,34.44 v33.53,30.63
PC14  (via drill 0.35)
  Top 0.152: v46.94,48.46 45.41,48.46 U$1.36 | 49.53,50.6 v47.55,50.6 | 49.53,50.6 50.75,51.82 Q2.2 | 49.53,50.6 v55.32,44.81 | v15.7,23.01 18.29,20.42 19.05,20.42 U$2.3
  Bottom 0.152: v46.94,48.46 46.94,49.99 v47.55,50.6 | v55.32,44.81 61.27,38.86 | 61.27,38.86 65.53,34.59 73.46,34.59 74.98,33.07 80.01,33.07 C1.2 | v15.7,23.01 15.7,18.59 19.66,14.63 52.88,14.63 55.63,17.37 55.63,30.63 54.71,31.55 54.71,32.31 61.27,38.86
PC15  (via drill 0.35)
  Top 0.152: v42.52,48.92 42.22,49.23 42.22,51.66 U$1.37 | v49.38,39.93 49.38,40.69 50.75,42.06 Q2.1 50.9,42.22 51.21,42.52 v53.8,42.52 53.8,36.42 55.93,34.29 55.93,29.26 55.32,28.65 50.14,28.65 48.62,27.13 48.62,23.62 48.92,23.32 v48.92,23.01
  Bottom 0.152: v42.52,48.92 42.52,48.01 42.22,47.7 42.22,47.09 v49.38,39.93 | C2.1 80.01,50.9 80.92,49.99 80.92,41.45 80.47,41 76.2,41 67.82,49.38 58.98,49.38 53.8,44.2 v53.8,42.52 | v48.92,23.01 46.33,20.42 21.64,20.42 U$2.4
RESET  (via drill 0.35)
  Top 0.152: v28.19,48.01 33.38,48.01 U$1.2 | v55.32,31.85 49.53,31.85 | R11.1 73.76,58.52 74.98,58.52 75.89,59.44 79.1,59.44 80.31,58.22 80.31,55.63 81.23,54.71 81.23,35.51 78.79,33.07 73.76,33.07 C14.1 | v32,31.7 39.93,31.7 41,32.77 48.62,32.77 49.53,31.85 | 49.53,31.85 1.2
  Bottom 0.152: v28.19,48.01 21.95,41.76 21.03,41.76 20.42,41.15 20.42,39.17 21.49,38.1 U$2.17 27.13,38.1 32,33.22 v32,31.7 | v55.32,31.85 72.54,31.85 73.61,32.92 C14.1
SWCLK  (via drill 0.35)
  Top 0.152: v40.69,41.3 39.17,41.3 38.71,40.84 38.71,39.78 U$1.17 | v48.16,39.62 48.77,39.62 49.38,39.01 v50.9,39.01 | R3.1 46.94,60.96 47.85,61.87 60.05,61.87 62.18,59.74 62.18,55.93 U$4.3
  Bottom 0.152: v40.69,41.3 42.37,39.62 v48.16,39.62 | v50.9,39.01 50.9,42.37 59.28,50.75 67.21,50.75 U$4.3
SWDIO  (via drill 0.35)
  Top 0.152: v38.1,36.73 38.1,39.62 U$1.16 | v51.36,20.57 58.22,20.57 60.96,17.83 R2.1
  Bottom 0.152: v38.1,36.73 38.1,36.12 41.45,32.77 42.82,32.77 48.62,26.98 48.62,26.21 49.07,25.76 50.14,25.76 51.05,24.84 51.05,20.88 v51.36,20.57 | U$4.2 72.39,53.34 78.49,59.44 81.53,59.44 82.3,58.67 82.3,33.98 79.7,31.39 79.55,31.39 74.98,26.82 74.98,25.45 68.28,18.75 61.87,18.75 60.96,17.83 R2.1
VBAT  (via drill 0.35)
  Top 0.152: v53.65,32.77 46.48,39.93 46.48,40.54 48.01,42.06 48.01,48.77 43.89,52.88 40.84,52.88 40.69,52.73 40.69,51.82 U$1.40 | v55.02,19.96 56.24,19.96 58.06,18.14 58.06,17.37 53.49,12.8 26.52,12.8 21.64,17.68 U$2.1
  Bottom 0.152: v53.65,32.77 53.65,21.95 55.02,20.57 v55.02,19.96
VCC  (via drill 0.35)
  Top 0.152: 71.02,35.66 73.61,35.66 C6.1 73.76,35.66 80.01,35.66 C7.1 | C13.1 71.02,35.66 | 68.58,21.64 C4.1 68.58,28.04 | 68.58,21.64 C5.1 | 68.58,21.64 73.61,21.64 C9.1 | 68.58,28.04 68.58,29.57 | 68.58,29.57 C3.1 71.02,32.92 71.02,35.66 | 68.58,28.04 73.61,28.04 C10.1 73.76,28.04 80.01,28.04 C8.1 | U$5.1 U$5.2 49.53,24.23 54.71,24.23 57.15,26.67 U$6.2 57.15,30.02 | 57.15,30.02 59.44,30.02 U$6.3 59.59,29.87 59.89,29.57 68.58,29.57 | U$1.44 38.71,51.66 39.01,51.66 U$1.43 39.17,51.66 39.62,51.66 | 39.62,51.66 40.08,51.66 U$1.41 40.23,51.82 40.23,52.73 40.69,53.19 44.04,53.19 46.18,51.05 | 39.62,51.66 U$1.42 | 46.18,51.05 57.15,40.08 U$6.4 57.15,30.02 | v51.51,56.39 46.18,51.05
  Bottom 0.152: U$2.18 19.05,38.56 14.94,42.67 14.94,64.77 17.37,67.21 20.42,67.21 U$2.40 21.64,65.99 33.07,65.99 38.1,60.96 R3.2 43.28,60.96 44.2,61.87 51.82,61.87 | 51.82,61.87 62.64,61.87 67.21,57.3 67.21,55.93 U$4.1 | v51.51,56.39 51.51,60.35 51.82,60.66 51.82,61.87